# Altium schematic sheet FMC_connector_EF.SchDoc: FMC Connector EF
size A; Author: James Thomas; CompanyName: BYUI; DrawnBy: James Thomas; Engineer: James Thomas; Organization: CSEE; DocumentNumber: 7; Revision: 0.0.1; SheetNumber: 7; SheetTotal: 15
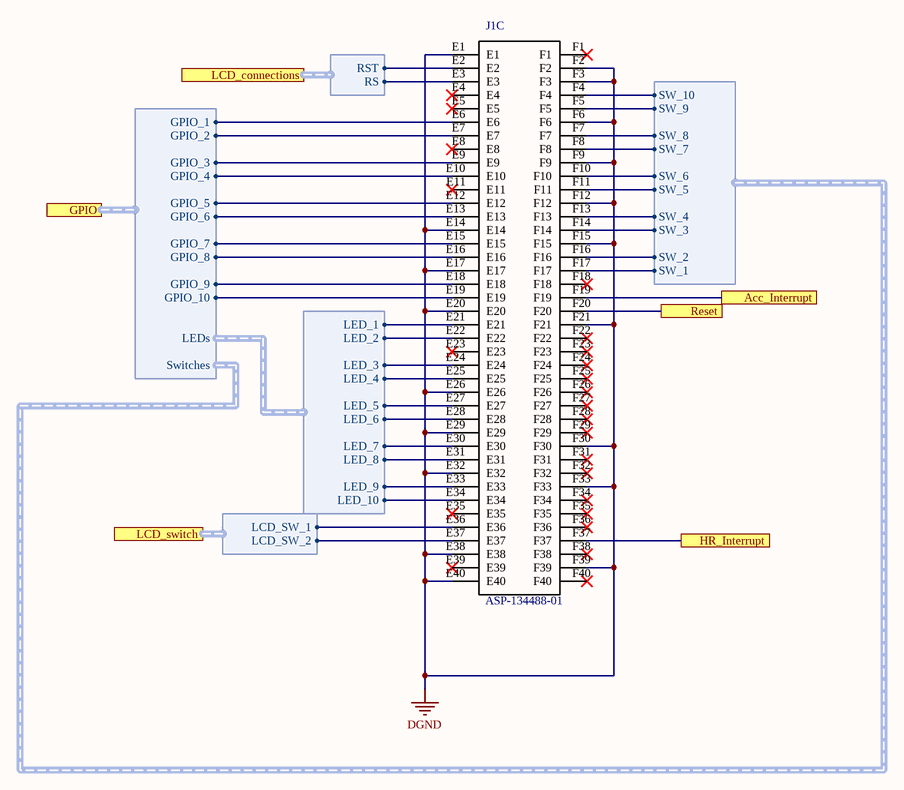
[diagram p0: FMC_connector_EF.SchDoc]

## Parts
J1  ASP-134488-01  [*SAMTEC_ASP-134488-01_ASP-134488-01(Primary)]  (part C of 5)

## Ports
Acc_Interrupt, GPIO (harness GPIO), HR_Interrupt, LCD_connections (harness LCD_connections), LCD_switch (harness LCD_switch), Reset

## Harnesses
LCD_connections: RST, RS
GPIO: GPIO_1, GPIO_2, GPIO_3, GPIO_4, GPIO_5, GPIO_6, GPIO_7, GPIO_8, GPIO_9, GPIO_10, LEDs, Switches
LED: LED_1, LED_2, LED_3, LED_4, LED_5, LED_6, LED_7, LED_8, LED_9, LED_10
SW: SW_10, SW_9, SW_8, SW_7, SW_6, SW_5, SW_4, SW_3, SW_2, SW_1
LCD_switch: LCD_SW_1, LCD_SW_2

## Nets
DGND: J1.E1 J1.E14 J1.E17 J1.E20 J1.E26 J1.E29 J1.E32 J1.E38 J1.E40 J1.F2 J1.F3 J1.F6 J1.F9 J1.F12 J1.F15 J1.F21 J1.F30 J1.F33 J1.F39
Acc_Interrupt: J1.F19 ; port Acc_Interrupt
HR_Interrupt: J1.F37 ; port HR_Interrupt
Reset: J1.F20 ; port Reset
NetJ1_E2: J1.E2 ; port LCD_connections.RST
NetJ1_E3: J1.E3 ; port LCD_connections.RS
NetJ1_E6: J1.E6 ; port GPIO.GPIO_1
NetJ1_E7: J1.E7 ; port GPIO.GPIO_2
NetJ1_E9: J1.E9 ; port GPIO.GPIO_3
NetJ1_E10: J1.E10 ; port GPIO.GPIO_4
NetJ1_E12: J1.E12 ; port GPIO.GPIO_5
NetJ1_E13: J1.E13 ; port GPIO.GPIO_6
NetJ1_E15: J1.E15 ; port GPIO.GPIO_7
NetJ1_E16: J1.E16 ; port GPIO.GPIO_8
NetJ1_E18: J1.E18 ; port GPIO.GPIO_9
NetJ1_E19: J1.E19 ; port GPIO.GPIO_10
NetJ1_E21: J1.E21 ; harness LED.LED_1
NetJ1_E22: J1.E22 ; harness LED.LED_2
NetJ1_E24: J1.E24 ; harness LED.LED_3
NetJ1_E25: J1.E25 ; harness LED.LED_4
NetJ1_E27: J1.E27 ; harness LED.LED_5
NetJ1_E28: J1.E28 ; harness LED.LED_6
NetJ1_E30: J1.E30 ; harness LED.LED_7
NetJ1_E31: J1.E31 ; harness LED.LED_8
NetJ1_E33: J1.E33 ; harness LED.LED_9
NetJ1_E34: J1.E34 ; harness LED.LED_10
NetJ1_E36: J1.E36 ; port LCD_switch.LCD_SW_1
NetJ1_E37: J1.E37 ; port LCD_switch.LCD_SW_2
NetJ1_F4: J1.F4 ; harness SW.SW_10
NetJ1_F5: J1.F5 ; harness SW.SW_9
NetJ1_F7: J1.F7 ; harness SW.SW_8
NetJ1_F8: J1.F8 ; harness SW.SW_7
NetJ1_F10: J1.F10 ; harness SW.SW_6
NetJ1_F11: J1.F11 ; harness SW.SW_5
NetJ1_F13: J1.F13 ; harness SW.SW_4
NetJ1_F14: J1.F14 ; harness SW.SW_3
NetJ1_F16: J1.F16 ; harness SW.SW_2
NetJ1_F17: J1.F17 ; harness SW.SW_1

Not connected (* = marked no-connect by the designer): J1 E4* E5* E8* E11* E23* E35* E39* F1* F18* F22* F23* F24* F25* F26* F27* F28* F29* F31* F32* F34* F35* F36* F38* F40*

## Library data of the parts
J1 = ASP-134488-01: SnapEDA_Link: https://www.snapeda.com/parts/ASP-134488-01/Samtec%20Inc./view-part/423215/?ref=snap; Value: *